# Altium schematic sheet RFID.SchDoc
size 355 x 254 mm; SheetNumber: 2; SheetTotal: 4
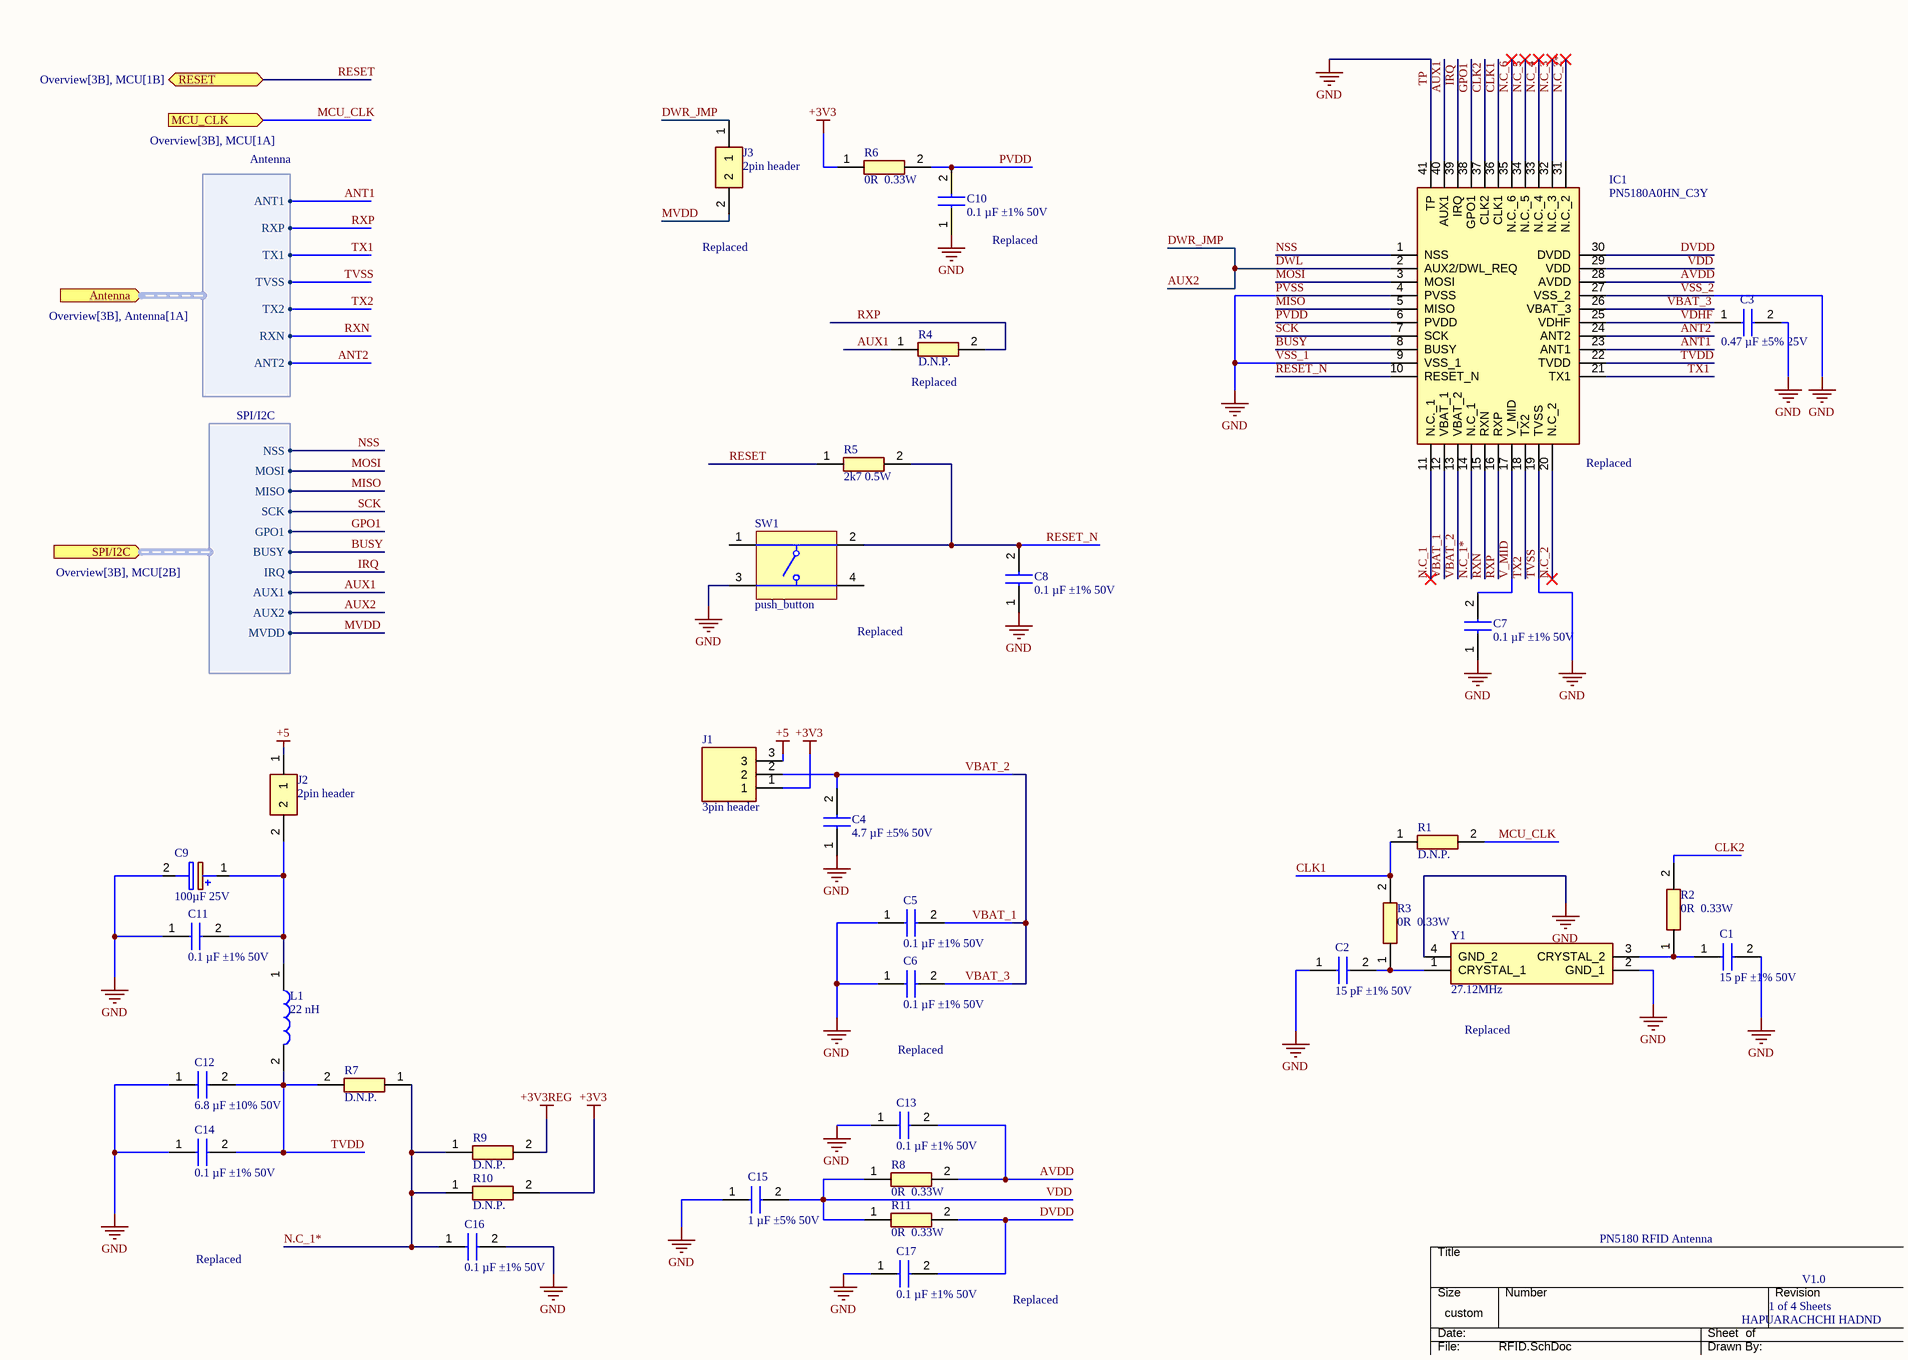
[diagram p0: RFID.SchDoc]

## Parts
C1  15 pF ±1% 50V  [C0805]
C2  15 pF ±1% 50V  [C0805]
C3  0.47 µF ±5% 25V  [CAPC1608X90N]
C4  4.7 µF ±5% 50V  [CAPC4532X279N]
C5  0.1 µF ±1% 50V  [GRT31x]
C6  0.1 µF ±1% 50V  [GRT31x]
C7  0.1 µF ±1% 50V  [GRT31x]
C8  0.1 µF ±1% 50V  [GRT31x]
C9  100µF 25V  [EEHZA1E101XP]
C10  0.1 µF ±1% 50V  [GRT31x]
C11  0.1 µF ±1% 50V  [GRT31x]
C12  6.8 µF ±10% 50V  [CAPC3216X180N]
C13  0.1 µF ±1% 50V  [GRT31x]
C14  0.1 µF ±1% 50V  [GRT31x]
C15  1 µF ±5% 50V  [RESC2012X140N]
C16  0.1 µF ±1% 50V  [GRT31x]
C17  0.1 µF ±1% 50V  [GRT31x]
IC1  PN5180A0HN_C3Y  [QFN50P600X600X100-41N-D]
J1  3pin header  [HDRV3W64P0X254_1X3_762X254X864P]
J2  2pin header  [HDRV2W110P0X254_1X2_508X254X854P]
J3  2pin header  [HDRV2W110P0X254_1X2_508X254X854P]
L1  22 nH  [INDC2012X115N]
R1  D.N.P.  [RESC1608X50N_DNP]  (no BOM)
R2  0R  0.33W  [RESC1608X50N_1]
R3  0R  0.33W  [RESC1608X50N_1]
R4  D.N.P.  [RESC1608X50N_DNP]  (no BOM)
R5  2k7 0.5W  [RESC2012X60N]
R6  0R  0.33W  [RESC1608X50N_1]
R7  D.N.P.  [RESC1608X50N_DNP]  (no BOM)
R8  0R  0.33W  [RESC1608X50N_1]
R9  D.N.P.  [RESC1608X50N_DNP]  (no BOM)
R10  D.N.P.  [RESC1608X50N_DNP]  (no BOM)
R11  0R  0.33W  [RESC1608X50N_1]
SW1  push_button  [TECO-1825910-6_V]
Y1  27.12MHz  [7M27120MEEQT]

## Ports
Antenna (in, harness Antenna, see Overview[3B], Antenna[1A]), MCU_CLK (in, see Overview[3B], MCU[1A]), RESET (bidir, see Overview[3B], MCU[1B]), SPI/I2C (in, harness SPI/I2C, see Overview[3B], MCU[2B])

## Harnesses
Antenna: ANT1, RXP, TX1, TVSS, TX2, RXN, ANT2
SPI/I2C: NSS, MOSI, MISO, SCK, GPO1, BUSY, IRQ, AUX1, AUX2, MVDD

## Nets
+3V3: J1.1 R6.1 R10.2
+3V3REG: R9.2
+5: J1.3 J2.1
PVSS: C1.2 C2.1 C3.2 C4.1 C5.1 C6.1 C7.1 C8.1 C9.2(-) C10.1 C11.1 C12.1 C13.1 C14.1 C15.1 C16.2 C17.1 IC1.4(PVSS) IC1.9(VSS_1) IC1.19(TVSS) IC1.27(VSS_2) IC1.41(TP) SW1.3 Y1.2(GND_1) Y1.4(GND_2) ; port Antenna.TVSS  [also labelled GND, TP, TVSS, VSS_1, VSS_2]
ANT1: IC1.23(ANT1) ; port Antenna.ANT1
ANT2: IC1.24(ANT2) ; port Antenna.ANT2
AUX1: IC1.40(AUX1) R4.1 ; port SPI/I2C.AUX1
AUX2: IC1.2(AUX2/DWL_REQ) J3.1 ; port SPI/I2C.AUX2  [also labelled DWL, DWR_JMP]
AVDD: C13.2 IC1.28(AVDD) R8.2
BUSY: IC1.8(BUSY) ; port SPI/I2C.BUSY
CLK1: IC1.36(CLK1) R1.1 R3.2
CLK2: IC1.37(CLK2) R2.2
DVDD: C17.2 IC1.30(DVDD) R11.2
GPO1: IC1.38(GPO1) ; port SPI/I2C.GPO1
IRQ: IC1.39(IRQ) ; port SPI/I2C.IRQ
MCU_CLK: R1.2 ; port MCU_CLK
MISO: IC1.5(MISO) ; port SPI/I2C.MISO
MOSI: IC1.3(MOSI) ; port SPI/I2C.MOSI
MVDD: J3.2 ; port SPI/I2C.MVDD
N.C_1: IC1.11(N.C._1)
N.C_1*: C16.1 IC1.14(N.C_1) R7.1 R9.1 R10.1
N.C_2: IC1.20(N.C_2)
N.C_2*: IC1.31(N.C._2)
N.C_3: IC1.32(N.C._3)
N.C_4: IC1.33(N.C._4)
N.C_5: IC1.34(N.C._5)
N.C_6: IC1.35(N.C._6)
NSS: IC1.1(NSS) ; port SPI/I2C.NSS
PVDD: C10.2 IC1.6(PVDD) R6.2
RESET: R5.1 ; port RESET
RESET_N: C8.2 IC1.10(RESET_N) R5.2 SW1.2
RXN: IC1.15(RXN) ; port Antenna.RXN
RXP: IC1.16(RXP) R4.2 ; port Antenna.RXP
SCK: IC1.7(SCK) ; port SPI/I2C.SCK
TVDD: C12.2 C14.2 IC1.22(TVDD) L1.2 R7.2
TX1: IC1.21(TX1) ; port Antenna.TX1
TX2: IC1.18(TX2) ; port Antenna.TX2
V_MID: C7.2 IC1.17(V_MID)
VBAT_1: C4.2 C5.2 C6.2 IC1.12(VBAT_1) IC1.13(VBAT_2) IC1.26(VBAT_3) J1.2  [also labelled VBAT_2, VBAT_3]
VDD: C15.2 IC1.29(VDD) R8.1 R11.1
VDHF: C3.1 IC1.25(VDHF)
NetC1_1: C1.1 R2.1 Y1.3(CRYSTAL_2)
NetC2_2: C2.2 R3.1 Y1.1(CRYSTAL_1)
NetC9_1: C9.1(+) C11.2 J2.2 L1.1

Not connected (* = marked no-connect by the designer): SW1 1 4

## Notes on the sheet
- Replaced
- (near C10) Replaced
- (near R4) Replaced
- (near IC1) Replaced
- (near SW1) Replaced
- PN5180 RFID Antenna
- 1 of 4 Sheets
- V1.0
- HAPUARACHCHI HADND
- THIS DOCUMENT AND THE DATA DISCLOSED HEREIN OR
- HEREWITH IS THE PROPERTY OF ALTIUM LIMITED AND MAY
- DWG NO:
- REVISION
- REV:
- DESCRIPTION
- DATE
- APPROVED
- BE FREELY DISTRIBUTED IN WHOLE. NO RIGHTS ARE
- RESERVED OR EXPRESS OR IMPLIED WARANTEE GIVEN.
- ENG:
- APPROVALS
- PROJECT
- DSN:
- CHK:
- REFERENCE DOCUMENTS
- PROJECT REVISION:
- TITLE
- DOCUMENT REVISION:
- DESIGN ITEM:
- BOM:
- FAB DWG:
- PCB DWG:
- ASSY DWG:
- SCALE:
- A3
- SIZE
- CAGE CODE
- FILE NAME
- DWG NO.
- SHEET
- OF
- REV

## Library data of the parts
C1 C2 = 15pF: 15 pF ±1% 50V Ceramic Capacitor C0G, NP0 0805 (2012 Metric); Manufacturer_Name: KEMET; Manufacturer_Part_Number: C0805C150F5GACTU; Datasheet Link: https://content.kemet.com/datasheets/KEM_C1003_C0G_SMD.pdf; Height: 1.1mm; Mouser Part Number: 80-C0805C150F5GACTU; Mouser Price/Stock: https://www.mouser.com/Search/Refine.aspx?Keyword=80-C0805C150F5GACTU
C3 = 470nF: 0.47 µF ±5% 25V Ceramic Capacitor X7R 0603 (1608 Metric); Manufacturer_Name: Kyocera AVX; Manufacturer_Part_Number: 06033C474JAT2A; Datasheet Link: https://componentsearchengine.com/Datasheets/1/06031A100FAT2A.pdf; Height: 0.9mm; Mouser Part Number: 581-06033C474JAT2A; Mouser Price/Stock: https://www.mouser.com/Search/Refine.aspx?Keyword=581-06033C474JAT2A
C4 = 4.7uF: 4.7 µF ±5% 50V Ceramic Capacitor X7R 1812 (4532 Metric); Manufacturer_Name: Kyocera AVX; Manufacturer_Part_Number: 18125C475JAT2A; Datasheet Link: https://datasheets.kyocera-avx.com/X7RDielectric.pdf; Height: 2.79mm; Mouser Part Number: 581-18125C475JAT2A; Mouser Price/Stock: https://www.mouser.com/Search/Refine.aspx?Keyword=581-18125C475JAT2A; Arrow Part Number: 18125C475JAT2A; Arrow Price/Stock: https://www.arrow.com/en/products/18125c475jat2a/avx
C5-C8 C10 C11 C13 C14 C16 C17 = 100nF: 0.1 µF ±1% 50V Ceramic Capacitor C0G, NP0 1206 (3216 Metric); Manufacturer_Name: Murata Electronics; Manufacturer_Part_Number: GRT31C5C1H104FA02L; Datasheet Link: https://search.murata.co.jp/Ceramy/image/img/A01X/G101/ENG/GRT31C5C1H104FA02-01A.pdf; Height: 1.25mm; Mouser Part Number: 81-GRT31C5C1H104FA2L; Mouser Price/Stock: https://www.mouser.co.uk/ProductDetail/Murata-Electronics/GRT31C5C1H104FA02L?qs=xZ%2FP%252Ba9zWqakAIIZeEzSxA%3D%3D; Arrow Part Number: GRT31C5C1H104FA02L; Arrow Price/Stock: https://www.arrow.com/en/products/grt31c5c1h104fa02l/murata-manufacturing?region=nac
C9 = 100µF: Capacitor Polarised. Aluminum Organic Polymer Capacitors 100uF 25volt AEC-Q200; Manufacturer_Name: Panasonic; Manufacturer_Part_Number: EEH-ZA1E101XP; Datasheet Link: http://industrial.panasonic.com/cdbs/www-data/pdf/RDD0000/ABA0000C1221.pdf; Height: 8.3mm; Mouser Part Number: 667-EEH-ZA1E101XP; Mouser Price/Stock: https://www.mouser.co.uk/ProductDetail/Panasonic/EEH-ZA1E101XP?qs=7UCyOFMWVHbBL6OBgRrCPQ%3D%3D
C12 = 6.8uF: 6.8 µF ±10% 50V Ceramic Capacitor X5R 1206 (3216 Metric); Manufacturer_Name: TDK; Manufacturer_Part_Number: C3216X5R1H685K160AB; Datasheet Link: https://product.tdk.com/info/en/catalog/datasheets/mlcc_commercial_midvoltage_en.pdf; Height: 1.8mm; Mouser Part Number: 810-C3216X5R1H685K; Mouser Price/Stock: https://www.mouser.co.uk/ProductDetail/TDK/C3216X5R1H685K160AB?qs=LcTL%2F5vFEzHV52DL6DPbFg%3D%3D; Arrow Part Number: C3216X5R1H685K160AB; Arrow Price/Stock: https://www.arrow.com/en/products/c3216x5r1h685k160ab/tdk
C15 = 1uF: 1 µF ±5% 50V Ceramic Capacitor X7R 0805 (2012 Metric); Manufacturer_Name: Kyocera AVX; Manufacturer_Part_Number: 08055C105JAT2A; Datasheet Link: https://componentsearchengine.com/Datasheets/1/08055C105JAT2A.pdf; Height: 1.4mm; Mouser Part Number: 581-08055C105JAT2A; Mouser Price/Stock: https://www.mouser.co.uk/ProductDetail/KYOCERA-AVX/08055C105JAT2A?qs=tIBUQlZETBw4JiKO8J7C1w%3D%3D; Arrow Part Number: 08055C105JAT2A; Arrow Price/Stock: https://www.arrow.com/en/products/08055c105jat2a/avx
IC1 = PN5180A0HN_C3Y: RF Front End High-Performance Multi-protocol Full NFC Forum-compliant Frontend PN5180A0HN/C3Y; Manufacturer_Name: NXP; Datasheet Link: https://datasheet.datasheetarchive.com/originals/distributors/DKDS-31/606841.pdf; Height: 1mm; Manufacturer_Part_Number: PN5180A0HN/C3Y; Mouser Part Number: 771-PN5180A0HN/C3Y; Mouser Price/Stock: https://www.mouser.co.uk/ProductDetail/NXP-Semiconductors/PN5180A0HN-C3Y?qs=1mbolxNpo8fIXIFwLHRV2A%3D%3D; Arrow Part Number: PN5180A0HN/C3Y; Arrow Price/Stock: https://www.arrow.com/en/products/pn5180a0hnc3y/nxp-semiconductors?utm_currency=USD&region=nac
J1 = 3pin header: Connector Header Through Hole 3 position 0.100" (2.54mm); Manufacturer_Name: Harwin; Manufacturer_Part_Number: M20-9990345; Datasheet Link: https://cdn.harwin.com/pdfs/M20-999.pdf; Height: 8.64mm; Mouser Part Number: 855-M20-9990345; Mouser Price/Stock: https://www.mouser.co.uk/ProductDetail/Harwin/M20-9990345?qs=ulE8k0yEMYbl6ZPCtNdmpA%3D%3D
J2 J3 = 2pin header: Connector Header Through Hole 2 position 0.100" (2.54mm); Manufacturer_Name: Wurth Elektronik; Manufacturer_Part_Number: 61300211121; Datasheet Link: https://componentsearchengine.com/Datasheets/2/61300211121.pdf; Height: 8.54mm; Mouser Part Number: 710-61300211121; Mouser Price/Stock: https://www.mouser.co.uk/ProductDetail/Wurth-Elektronik/61300211121?qs=t4813l51qx%252B1A5GYDQxPlw%3D%3D
L1 = 22nH: 22 nH Unshielded Multilayer Inductor 300 mA 500mOhm Max 0805 (2012 Metric); Manufacturer_Name: ABRACON; Manufacturer_Part_Number: AIMC-0805-22NJ-T; Datasheet Link: https://abracon.com/Magnetics/new/AIMC-0805.pdf; Height: 1.15mm; Mouser Part Number: 815-AIMC-0805-22NJT; Mouser Price/Stock: https://www.mouser.com/Search/Refine.aspx?Keyword=815-AIMC-0805-22NJT; Arrow Part Number: AIMC-0805-22NJ-T; Arrow Price/Stock: https://www.arrow.com/en/products/aimc-0805-22nj-t/abracon
R1 R4 R7 R9 R10 = DNP: Thick Film Resistors - SMD D11/CRCW0603 0R0 ET2 e3; Manufacturer_Name: Vishay; Manufacturer_Part_Number: CRCW06030000Z0EI; Datasheet Link: http://www.vishay.com/docs/20035/dcrcwe3.pdf; Height: 0.5mm; Mouser Part Number: 71-CRCW06030000Z0EI; Mouser Price/Stock: https://www.mouser.co.uk/ProductDetail/Vishay-Dale/CRCW06030000Z0EI?qs=%252B6g0mu59x7L7KQG%252Bwwt0jQ%3D%3D; Arrow Part Number: CRCW06030000Z0EI; Arrow Price/Stock: https://www.arrow.com/en/products/crcw06030000z0ei/vishay?utm_currency=USD&region=nac
R2 R3 R6 R8 R11 = 0R: Thick Film Resistors - SMD D11/CRCW0603 0R0 ET2 e3; Manufacturer_Name: Vishay; Manufacturer_Part_Number: CRCW06030000Z0EI; Datasheet Link: http://www.vishay.com/docs/20035/dcrcwe3.pdf; Height: 0.5mm; Mouser Part Number: 71-CRCW06030000Z0EI; Mouser Price/Stock: https://www.mouser.co.uk/ProductDetail/Vishay-Dale/CRCW06030000Z0EI?qs=%252B6g0mu59x7L7KQG%252Bwwt0jQ%3D%3D; Arrow Part Number: CRCW06030000Z0EI; Arrow Price/Stock: https://www.arrow.com/en/products/crcw06030000z0ei/vishay?utm_currency=USD&region=nac
R5 = 2k7Ohm: 2.7 kOhms ±1% 0.5W, 1/2W Chip Resistor 0805 (2012 Metric) Automotive AEC-Q200, Pulse Withstanding Thick Film; Manufacturer_Name: Vishay; Manufacturer_Part_Number: CRCW08052K70FKEAHP; Datasheet Link: https://componentsearchengine.com/Datasheets/1/CRCW08051R00FKEAHP.pdf; Height: 0.6mm; Mouser Part Number: 71-CRCW08052K70FKEAH; Mouser Price/Stock: https://www.mouser.co.uk/ProductDetail/Vishay-Dale/CRCW08052K70FKEAHP?qs=40TFAHZMFvcOgTEige8g9Q%3D%3D; Arrow Part Number: CRCW08052K70FKEAHP; Arrow Price/Stock: https://www.arrow.com/en/products/crcw08052k70fkeahp/vishay?region=nac
SW1 = CMP-1684-00021-1: Tact Switch, SPST-NO, 0.05 A, -35 to 85 degC, 4-Pin THD, RoHS, Bulk; Part No: 1825910-6; Manufacturer: TE Connectivity; Maximum Contact Resistance: 100mOhm; Mechanical Life: 100000Cycles; Bushing Type: Unthreaded; Switch Configuration: OFF(ON); Maximum DC Voltage Rating: 24V; Contact Rating @ Voltage: 0.05A@24VDC; Actuator Color: Black; Body Orientation: Straight; Function: MomentaryContact; Illumination: N/R; Actuator Style: RoundButton; Actuator Material: PolybutyleneTerephthalate; Dielectric Strength: 500VAC; Pole Throw Configuration: SPST; Actuator Length: 1.4mm; Product Weight: N/A; Contact Material: CopperAlloy; Housing Material: N/A; Terminal Type: PCPins; Minimum Insulation Resistance: 100MOhm; Package Description: 4-Pin Through Hole Device, Body 5.99 x 5.99 mm, Pitch 6.5 mm; Package Reference: THD; Base Material: N/A; Manufacturer URL: http://www.te.com; Contact Plating: Silver; RoHS: Yes; Datasheet Version: Rev. C9; Electrical Life: 100000Cycles; Maximum AC Voltage Rating: N/A; Thread Size: N/R; Operating Temperature: -35to85C; Mounting: ThroughHole; Dimension: 5.99x5mm; Datasheet URL: http://www.te.com/commerce/DocumentDelivery/DDEController?Action=showdoc&DocId=Customer+Drawing%7F1825910%7FC9%7Fpdf%7FEnglish%7FENG_CD_1825910_C9.pdf%7F1825910-6; Family: 1825910; Seal Location: N/A; Seal Description: N/A; Packaging: N/A
Y1 = 27.12MHz: 27.12 MHz ±10ppm Crystal 10pF 50 Ohms 4-SMD, No Lead; Manufacturer_Name: TXC CORPORATION; Manufacturer_Part_Number: 7M-27.120MEEQ-T; Datasheet Link: http://www.txccrystal.com/images/pdf/7m-accuracy.pdf; Height: 0.8mm; Mouser Part Number: 717-7M-27.120MEEQ-T; Mouser Price/Stock: https://www.mouser.co.uk/ProductDetail/TXC-Corporation/7M-27.120MEEQ-T?qs=65dIHZNch5vpCedHjSv71Q%3D%3D; Arrow Part Number: 7M-27.120MEEQ-T; Arrow Price/Stock: https://www.arrow.com/en/products/7m-27.120meeq-t/txc-corporation?region=europe